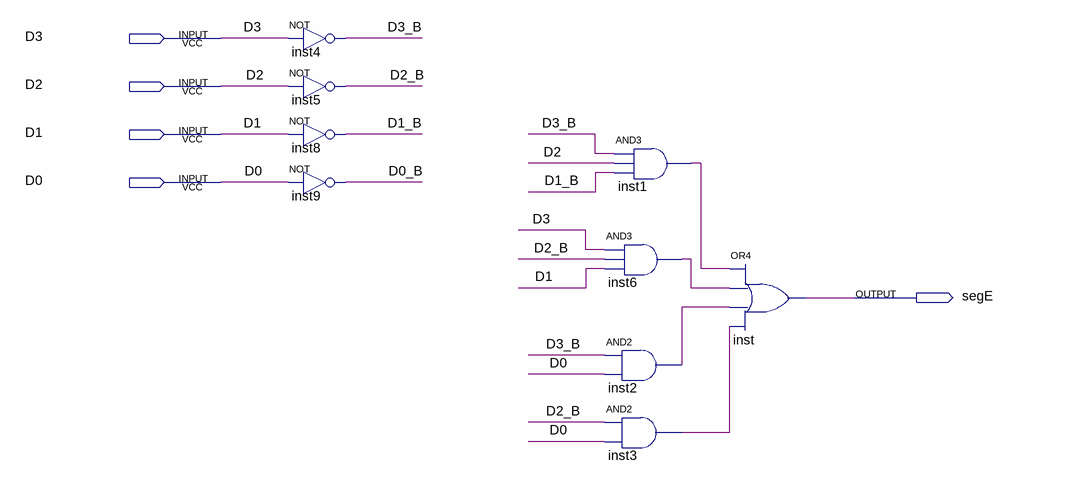
[diagram p0: schematic sheet]
// Quartus schematic segE.bdf as structural Verilog: 9 symbols, 5 pins
module segE (
  input  D3,
  input  D2,
  input  D1,
  input  D0,
  output segE
);

  wire D0_B, D1_B, D2_B, D3_B, inst1_out, inst2_out, inst3_out, inst6_out;

  not inst4 (D3_B, D3);
  not inst5 (D2_B, D2);
  not inst8 (D1_B, D1);
  not inst9 (D0_B, D0);
  and inst1 (inst1_out, D3_B, D2, D1_B);
  and inst6 (inst6_out, D3, D2_B, D1);
  and inst2 (inst2_out, D3_B, D0);
  and inst3 (inst3_out, D2_B, D0);
  or inst (segE, inst1_out, inst6_out, inst2_out, inst3_out);
endmodule
